# EAGLE schematic GUN PCB - SCHEMATICS (EAGLE 9.7.0)

## Sheet 1 of 5
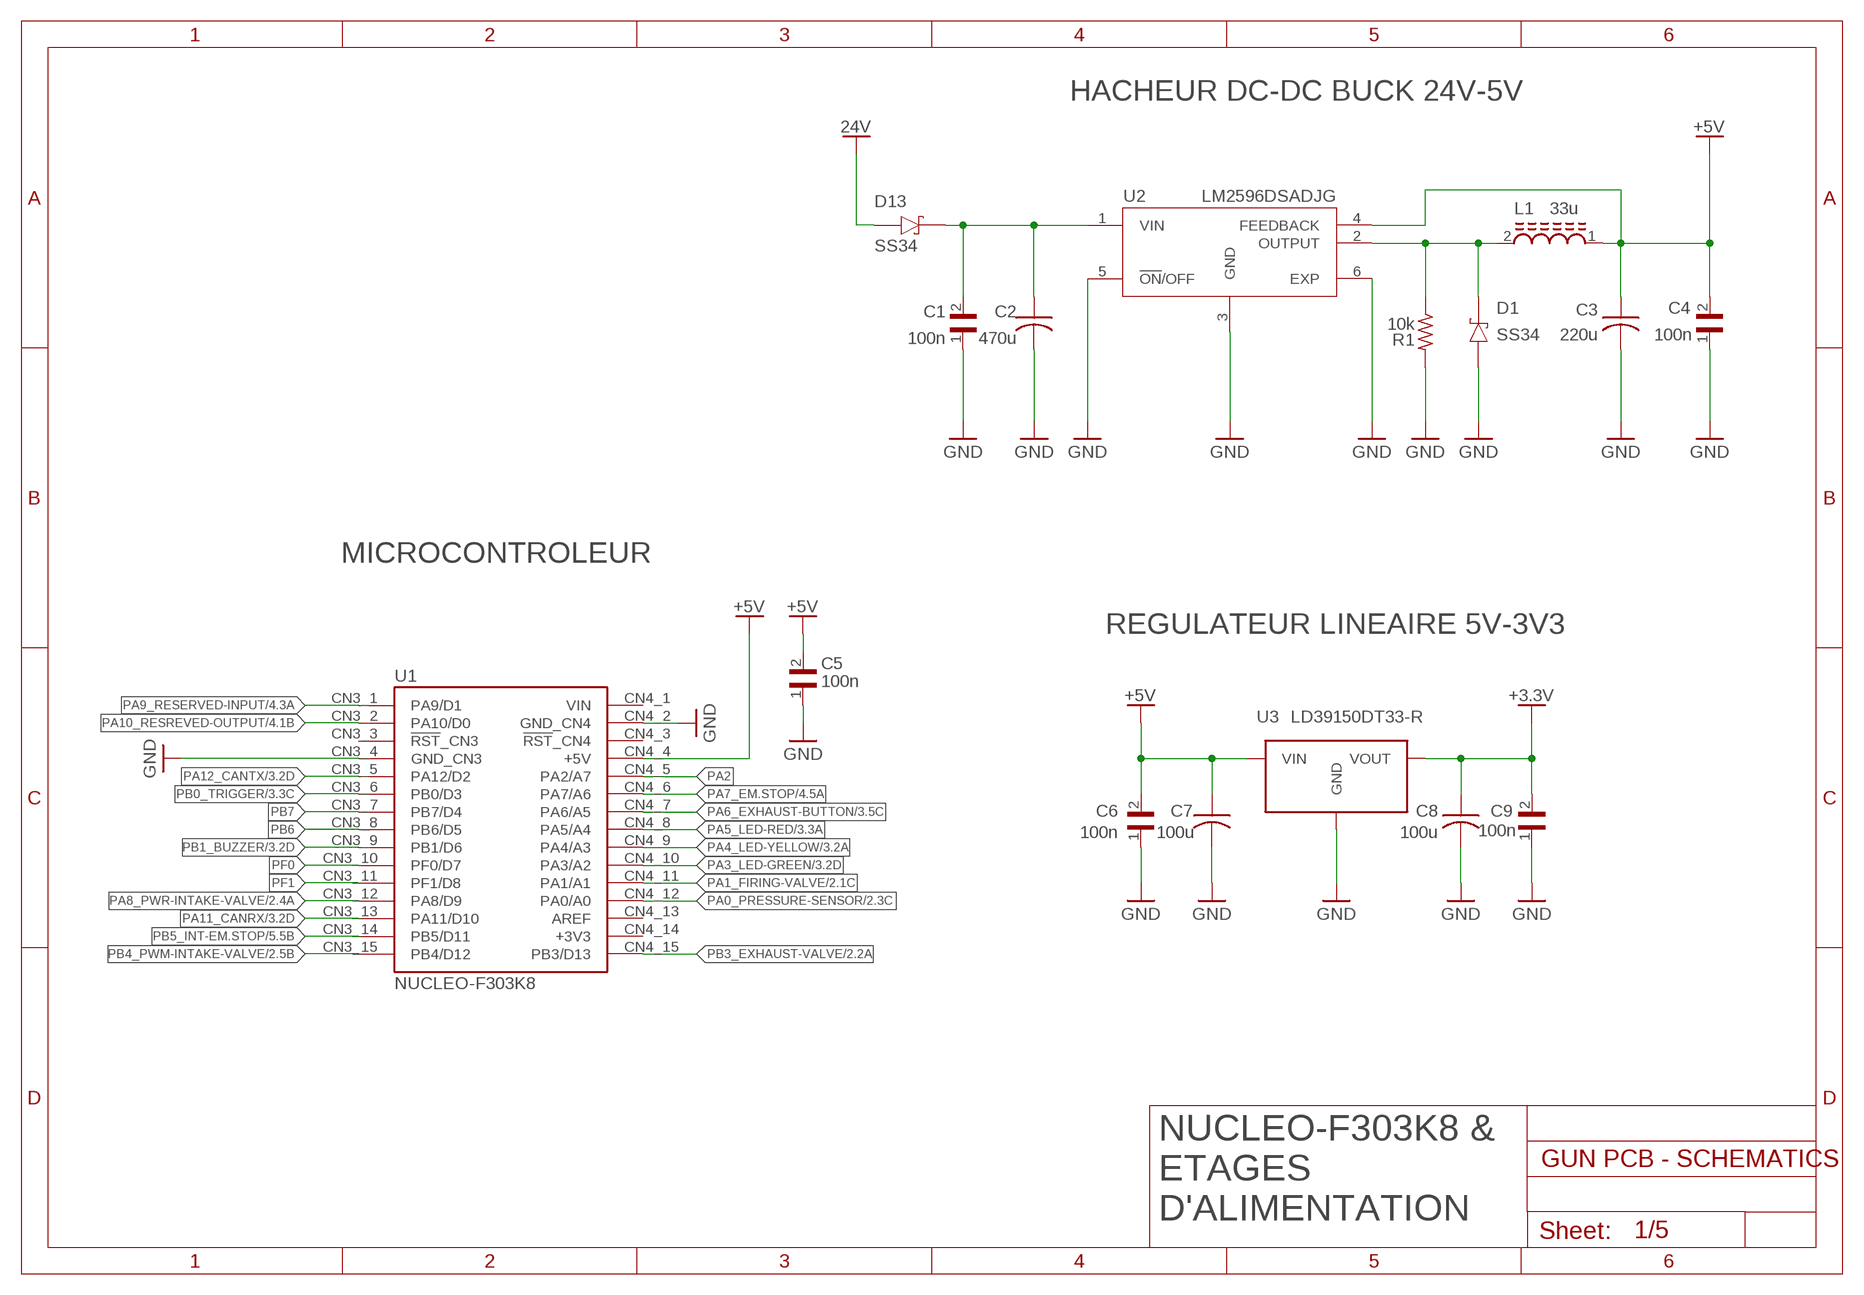
[diagram p0: schematic, sheet 1]

### Parts
C1  SR211C104KARTR1  [CAPRR508W50L508T317H508]
C2  ECA2CHG220  [CAPPRD500W60D1000H2000]
C3  EEUFC1E101SH  [CAPPRD250W50D630H1120]
C4  SR211C104KARTR1  [CAPRR508W50L508T317H508]
C5  SR211C104KARTR1  [CAPRR508W50L508T317H508]
C6  SR211C104KARTR1  [CAPRR508W50L508T317H508]
C7  ECEA1VKS470  [CAPPRD250W45D800H500]
C8  ECEA1VKS470  [CAPPRD250W45D800H500]
C9  SR211C104KARTR1  [CAPRR508W50L508T317H508]
D1  SS34  [DIO_SS34]
D13  SS34  [DIO_SS34]
L1  SRR1260-330M  [INDP125125X600N]
R1  10k  R-US_0204/7  [0204/7]
U1  NUCLEO-F042K6  [MODULE_NUCLEO-F042K6]
U2  LM2596DSADJG  [CONV_LM2596DSADJG]
U3  LD39150DT33-R  [DPAK]

### Nets
24V: D13.A ; also sheet 2,3,4
24V_SAFE: C1.2 C2.P D13.C(K) U2.1(VIN) ; also sheet 5
+3.3V: C8.P C9.2 U3.3(VOUT) ; also sheet 3,4,5
+5V: C3.P C4.2 C5.2 C6.2 C7.P L1.1 U1.CN4_4(+5V) U2.4(FEEDBACK) U3.1(VIN) ; also sheet 3,5
GND: C1.1 C2.N C3.N C4.1 C5.1 C6.1 C7.N C8.N C9.1 D1.A R1.2 U1.CN3_4(GND_CN3) U1.CN4_2(GND_CN4) U2.3(GND) U2.5(!ON!/OFF) U2.6(EXP) U3.2(GND) ; also sheet 2,3,4,5
N$2: D1.C(K) L1.2 R1.1 U2.2(OUTPUT)
PA0_PRESSURE-SENSOR: U1.CN4_12(PA0/A0) ; also sheet 2
PA1_FIRING-VALVE: U1.CN4_11(PA1/A1) ; also sheet 2
PA2: U1.CN4_5(PA2/A7)
PA3_LED-GREEN: U1.CN4_10(PA3/A2) ; also sheet 3
PA4_LED-YELLOW: U1.CN4_9(PA4/A3) ; also sheet 3
PA5_LED-RED: U1.CN4_8(PA5/A4) ; also sheet 3
PA6_EXHAUST-BUTTON: U1.CN4_7(PA6/A5) ; also sheet 3
PA7_EM.STOP: U1.CN4_6(PA7/A6) ; also sheet 4
PA8_PWR-INTAKE-VALVE: U1.CN3_12(PA8/D9) ; also sheet 2
PA9_RESERVED-INPUT: U1.CN3_1(PA9/D1) ; also sheet 4
PA10_RESREVED-OUTPUT: U1.CN3_2(PA10/D0) ; also sheet 4
PA11_CANRX: U1.CN3_13(PA11/D10) ; also sheet 3,5
PA12_CANTX: U1.CN3_5(PA12/D2) ; also sheet 3,5
PB0_TRIGGER: U1.CN3_6(PB0/D3) ; also sheet 3
PB1_BUZZER: U1.CN3_9(PB1/D6) ; also sheet 3
PB3_EXHAUST-VALVE: U1.CN4_15(PB3/D13) ; also sheet 2
PB4_PWM-INTAKE-VALVE: U1.CN3_15(PB4/D12) ; also sheet 2
PB5_INT-EM.STOP: U1.CN3_14(PB5/D11) ; also sheet 5
PB6: U1.CN3_8(PB6/D5)
PB7: U1.CN3_7(PB7/D4)
PF0: U1.CN3_10(PF0/D7)
PF1: U1.CN3_11(PF1/D8)
Unconnected: U1.CN3_3(!RST!_CN3) U1.CN4_3(!RST!_CN4) U1.CN4_13(AREF)

### Notes on the sheet
- HACHEUR DC-DC BUCK 24V-5V
- 33u
- 100n | 470u | 220u | 100n
- MICROCONTROLEUR
- REGULATEUR LINEAIRE 5V-3V3
- C5
- 100n
- 100n | 100u | 100u | 100n
- NUCLEO-F303K8
- NUCLEO-F303K8 &
  ETAGES 
  D'ALIMENTATION

## Sheet 2 of 5
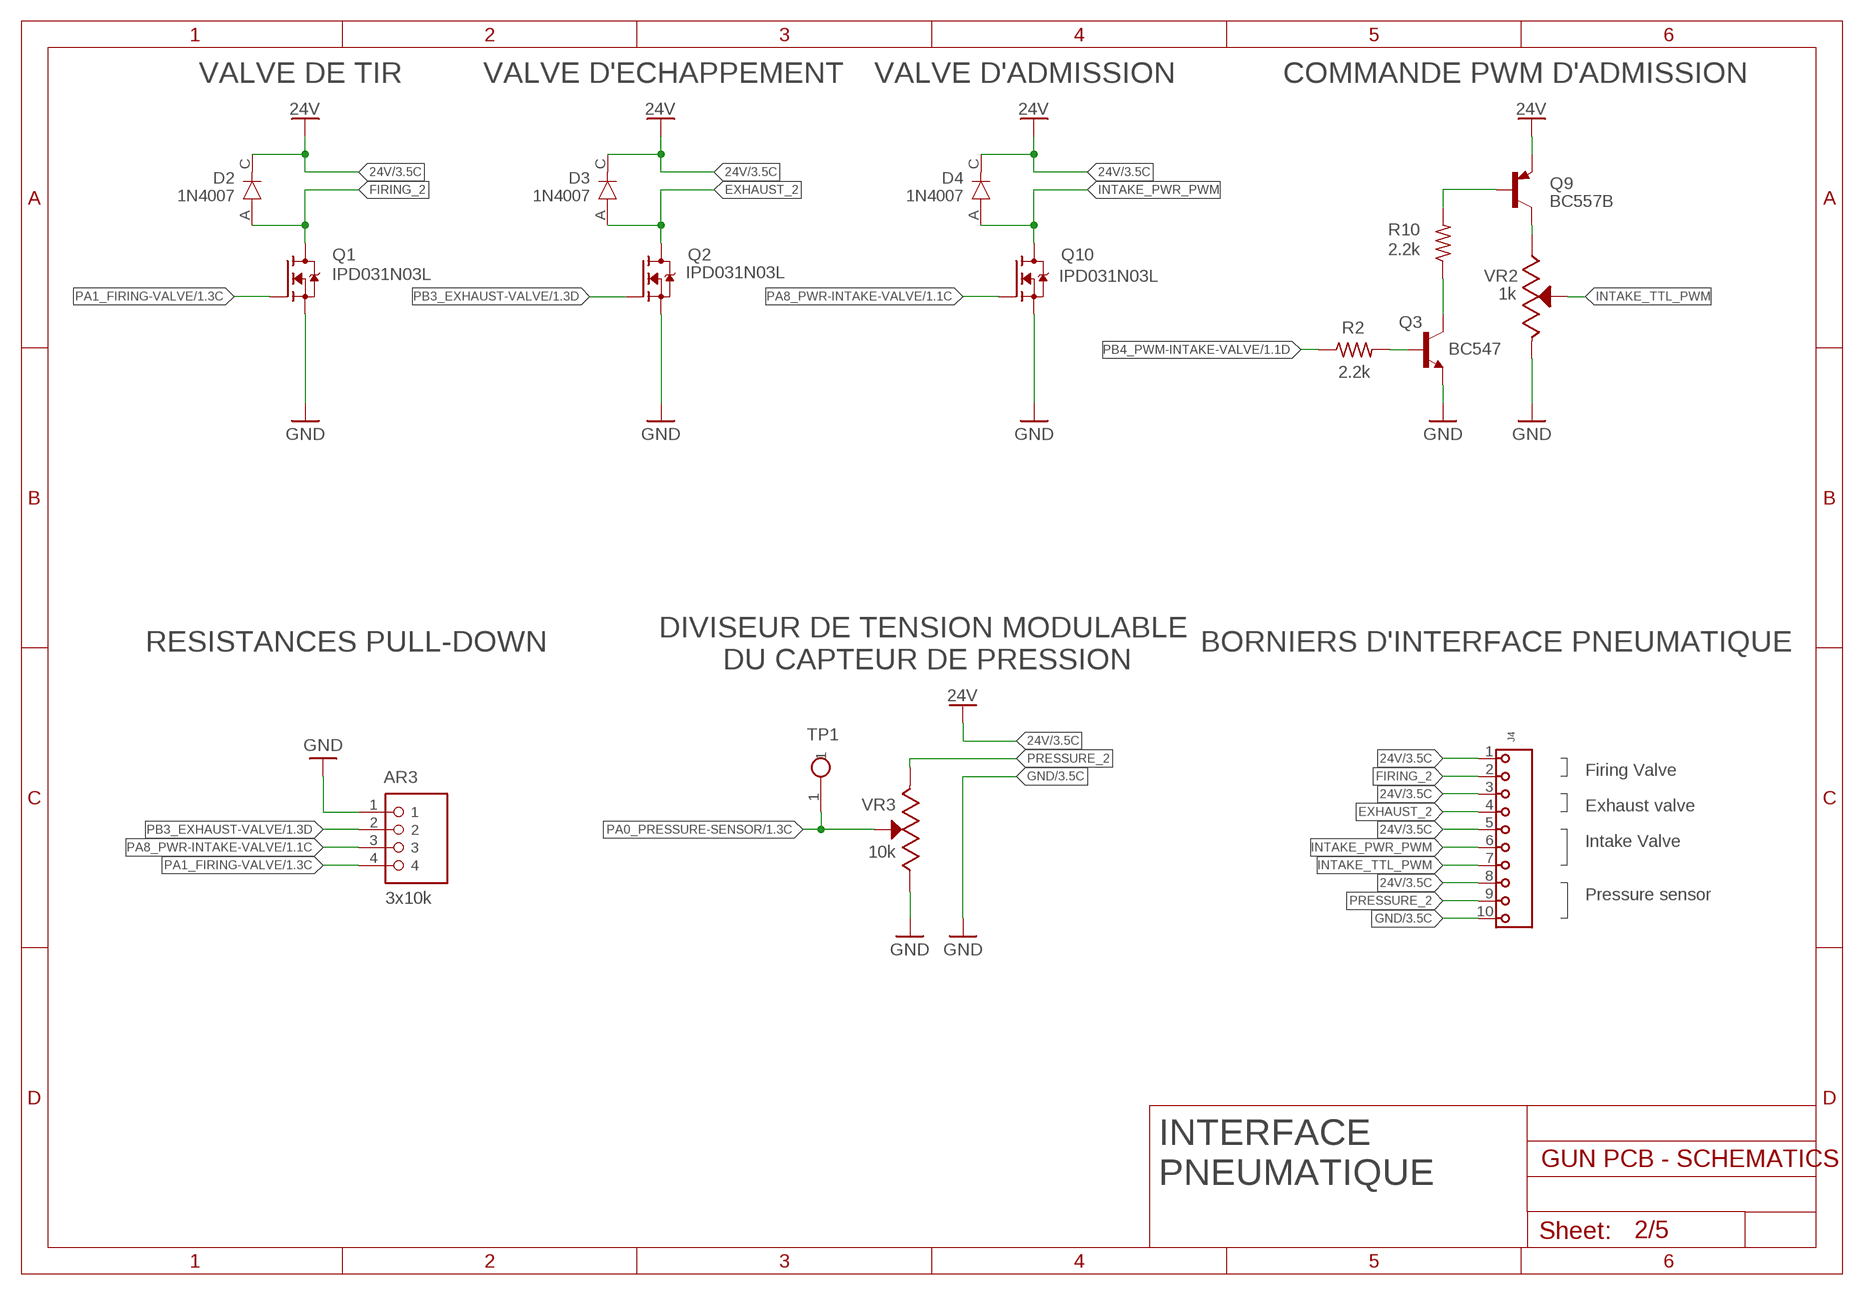
[diagram p1: schematic, sheet 2]

### Parts
AR3  10K10KX4  [10K]
D2  1N4007  [DIOAD1060W80L520D270]
D3  1N4007  [DIOAD1060W80L520D270]
D4  1N4007  [DIOAD1060W80L520D270]
J4  691241510010  [691241510010]
Q1  IRF520NSTRL  [TRANS_IRF520NSTRL]
Q2  IRF520NSTRL  [TRANS_IRF520NSTRL]
Q3  BC547  [TO92]
Q9  BC557B  [TO92254P460H750-3]
Q10  IRF520NSTRL  [TRANS_IRF520NSTRL]
R2  2.2k  R-US_0204/7  [0204/7]
R10  2.2k  R-US_0204/7  [0204/7]
TP1  TP  [TP355X200]
VR2  3296W-1-502  [TRIM_3296W-1-502]
VR3  3299Y-1-104LF  [3299Y1104LF]

### Nets
24V: D2.C D3.C D4.C J4.1 J4.3 J4.5 J4.8 Q9.3(E) ; also sheet 1,3,4
EXHAUST_2: D3.A J4.4 Q2.2(D)
FIRING_2: D2.A J4.2 Q1.2(D)
GND: AR3.1 J4.10 Q1.3(S) Q2.3(S) Q3.1(E) Q10.3(S) VR2.3(CW) VR3.1 ; also sheet 1,3,4,5
INTAKE_PWR_PWM: D4.A J4.6 Q10.2(D)
INTAKE_TTL_PWM: J4.7 VR2.2(WIPER)
N$3: Q3.2(B) R2.2
N$5: Q3.3(C) R10.1
N$6: Q9.2(B) R10.2
N$7: Q9.1(C) VR2.1(CCW)
PA0_PRESSURE-SENSOR: TP1.1 VR3.2 ; also sheet 1
PA1_FIRING-VALVE: AR3.4 Q1.1(G) ; also sheet 1
PA8_PWR-INTAKE-VALVE: AR3.3 Q10.1(G) ; also sheet 1
PB3_EXHAUST-VALVE: AR3.2 Q2.1(G) ; also sheet 1
PB4_PWM-INTAKE-VALVE: R2.1 ; also sheet 1
PRESSURE_2: J4.9 VR3.3

### Notes on the sheet
- VALVE DE TIR | VALVE D'ECHAPPEMENT | VALVE D'ADMISSION | COMMANDE PWM D'ADMISSION
- IPD031N03L | IPD031N03L | IPD031N03L
- 1k
- RESISTANCES PULL-DOWN | BORNIERS D'INTERFACE PNEUMATIQUE
- DIVISEUR DE TENSION MODULABLE 
  DU CAPTEUR DE PRESSION
- Firing Valve
- Exhaust valve
- 10k | Intake Valve
- 3x10k | Pressure sensor
- INTERFACE 
  PNEUMATIQUE

## Sheet 3 of 5
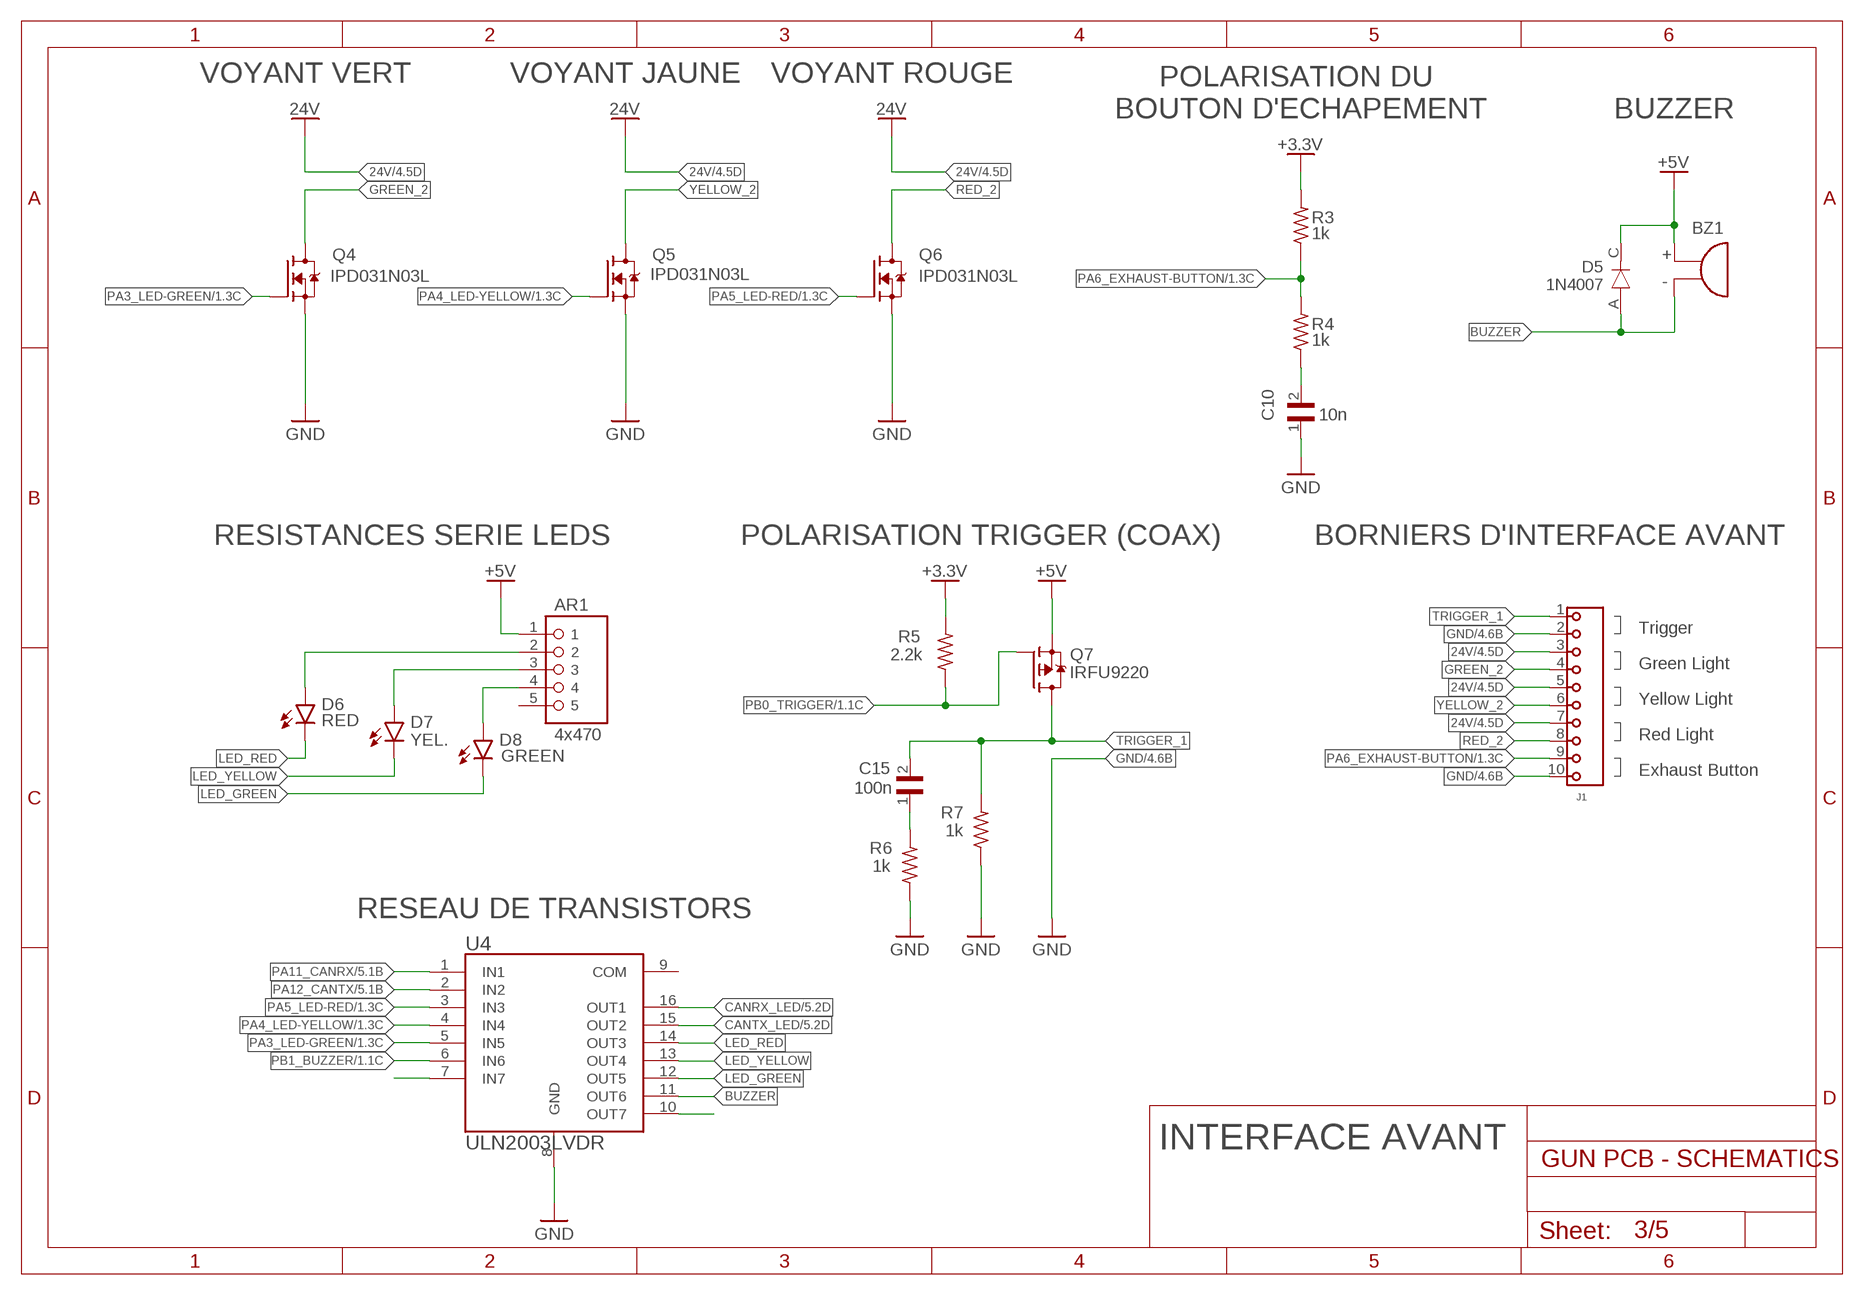
[diagram p2: schematic, sheet 3]

### Parts
AR1  470  [470]
BZ1  KSSG1201-16  [XDCR_KSSG1201-16]
C10  SR211C104KARTR1  [CAPRR508W50L508T317H508]
C15  SR211C104KARTR1  [CAPRR508W50L508T317H508]
D5  1N4007  [DIOAD1060W80L520D270]
D6  LED_RADIALRED  [LEDRD254W60D565H860B_R]
D7  LED_RADIALYELLOW  [LEDRD254W60D565H860B_Y]
D8  LED_RADIALWHITE  [LEDRD254W60D565H860B_W]
J1  691241510010  [691241510010]
Q4  IRF520NSTRL  [TRANS_IRF520NSTRL]
Q5  IRF520NSTRL  [TRANS_IRF520NSTRL]
Q6  IRF520NSTRL  [TRANS_IRF520NSTRL]
Q7  IRFU9220  [TO229P673X239X978-3N]
R3  1k  R-US_0204/7  [0204/7]
R4  1k  R-US_0204/7  [0204/7]
R5  2.2k  R-US_0204/7  [0204/7]
R6  1k  R-US_0204/7  [0204/7]
R7  1k  R-US_0204/7  [0204/7]
U4  ULN2003LVDR  [SOIC127P600X175-16N]

### Nets
24V: J1.3 J1.5 J1.7 ; also sheet 1,2,4
+3.3V: R3.2 R5.2 ; also sheet 1,4,5
+5V: AR1.1 BZ1.P(POS) D5.C Q7.3(S) ; also sheet 1,5
BUZZER: BZ1.N(NEG) D5.A U4.11(OUT6)
CANRX_LED: U4.16(OUT1) ; also sheet 5
CANTX_LED: U4.15(OUT2) ; also sheet 5
GND: C10.1 J1.2 J1.10 Q4.3(S) Q5.3(S) Q6.3(S) R6.1 R7.1 U4.8(GND) ; also sheet 1,2,4,5
GREEN_2: J1.4 Q4.2(D)
LED_GREEN: D8.C U4.12(OUT5)
LED_RED: D6.C U4.14(OUT3)
LED_YELLOW: D7.C U4.13(OUT4)
N$4: C15.1 R6.2
N$8: C10.2 R4.1
N$19: U4.7(IN7)
N$21: AR1.2 D6.A
N$22: AR1.4 D8.A
N$23: AR1.3 D7.A
N$29: U4.10(OUT7)
PA3_LED-GREEN: Q4.1(G) U4.5(IN5) ; also sheet 1
PA4_LED-YELLOW: Q5.1(G) U4.4(IN4) ; also sheet 1
PA5_LED-RED: Q6.1(G) U4.3(IN3) ; also sheet 1
PA6_EXHAUST-BUTTON: J1.9 R3.1 R4.2 ; also sheet 1
PA11_CANRX: U4.1(IN1) ; also sheet 1,5
PA12_CANTX: U4.2(IN2) ; also sheet 1,5
PB0_TRIGGER: Q7.1(G) R5.1 ; also sheet 1
PB1_BUZZER: U4.6(IN6) ; also sheet 1
RED_2: J1.8 Q6.2(D)
TRIGGER_1: C15.2 J1.1 Q7.2(D) R7.2
YELLOW_2: J1.6 Q5.2(D)
Unconnected: AR1.5 U4.9(COM)

### Notes on the sheet
- VOYANT VERT | VOYANT JAUNE | VOYANT ROUGE
- POLARISATION DU 
  BOUTON D'ECHAPEMENT
- BUZZER
- IPD031N03L | IPD031N03L | IPD031N03L
- 10n
- RESISTANCES SERIE LEDS | POLARISATION TRIGGER (COAX) | BORNIERS D'INTERFACE AVANT
- Trigger
- Green Light
- Yellow Light
- RED
- 4x470 | Red Light
- YEL.
- GREEN
- Exhaust Button
- 100n
- RESEAU DE TRANSISTORS
- INTERFACE AVANT

## Sheet 4 of 5
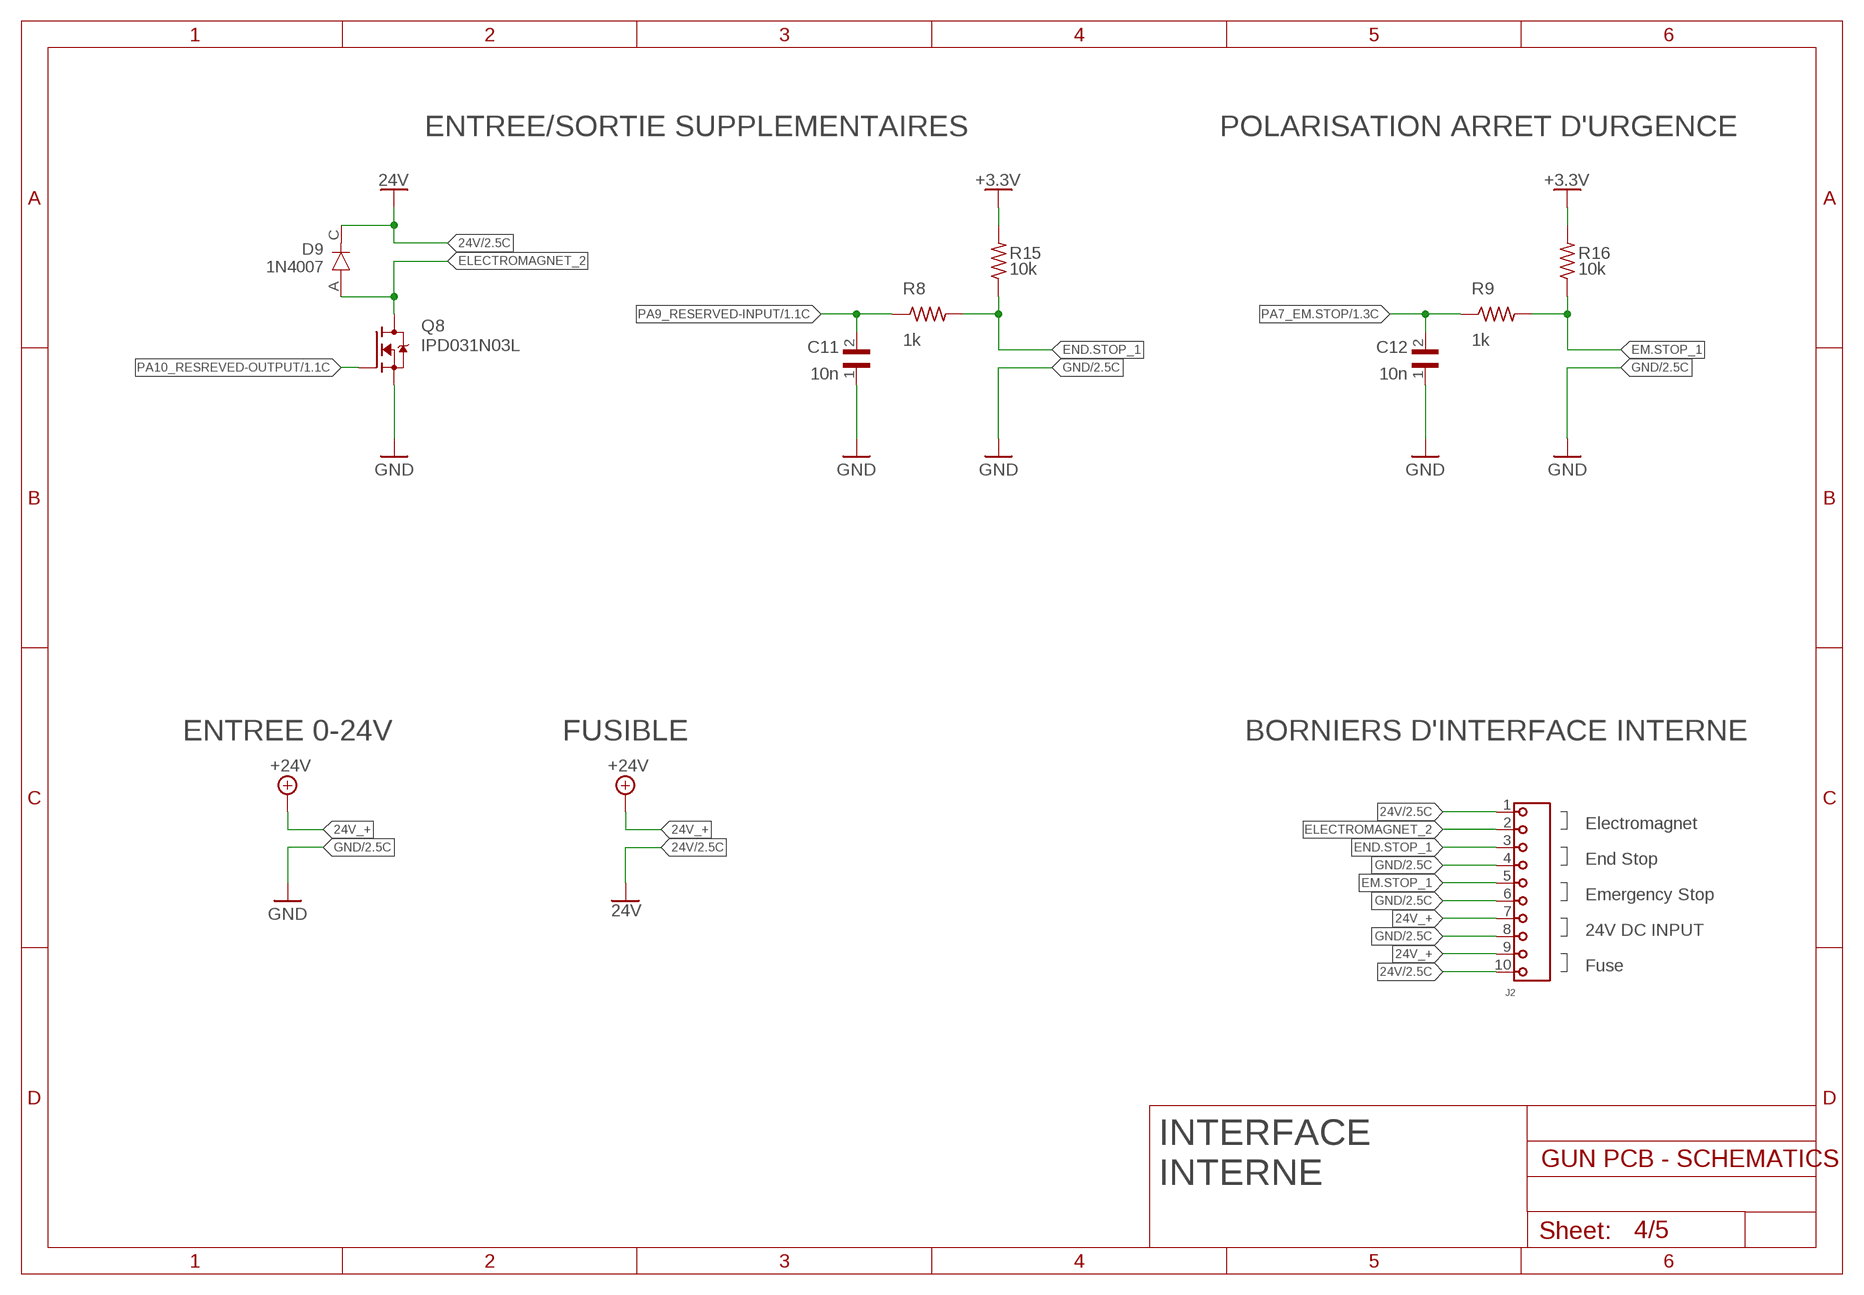
[diagram p3: schematic, sheet 4]

### Parts
C11  SR211C104KARTR1  [CAPRR508W50L508T317H508]
C12  SR211C104KARTR1  [CAPRR508W50L508T317H508]
D9  1N4007  [DIOAD1060W80L520D270]
J2  691241510010  [691241510010]
Q8  IRF520NSTRL  [TRANS_IRF520NSTRL]
R8  1k  R-US_0204/7  [0204/7]
R9  1k  R-US_0204/7  [0204/7]
R15  10k  R-US_0204/7  [0204/7]
R16  10k  R-US_0204/7  [0204/7]

### Nets
24V: D9.C J2.1 J2.10 ; also sheet 1,2,3
24V_+: J2.7 J2.9 ; supply symbol labelled +24V
+3.3V: R15.2 R16.2 ; also sheet 1,3,5
ELECTROMAGNET_2: D9.A J2.2 Q8.2(D)
EM.STOP_1: J2.5 R9.2 R16.1
END.STOP_1: J2.3 R8.2 R15.1
GND: C11.1 C12.1 J2.4 J2.6 J2.8 Q8.3(S) ; also sheet 1,2,3,5
PA7_EM.STOP: C12.2 R9.1 ; also sheet 1
PA9_RESERVED-INPUT: C11.2 R8.1 ; also sheet 1
PA10_RESREVED-OUTPUT: Q8.1(G) ; also sheet 1

### Notes on the sheet
- ENTREE/SORTIE SUPPLEMENTAIRES | POLARISATION ARRET D'URGENCE
- IPD031N03L
- 10n | 10n
- ENTREE 0-24V | FUSIBLE | BORNIERS D'INTERFACE INTERNE
- Electromagnet
- End Stop
- Emergency Stop
- 24V DC INPUT
- Fuse
- INTERFACE 
  INTERNE

## Sheet 5 of 5
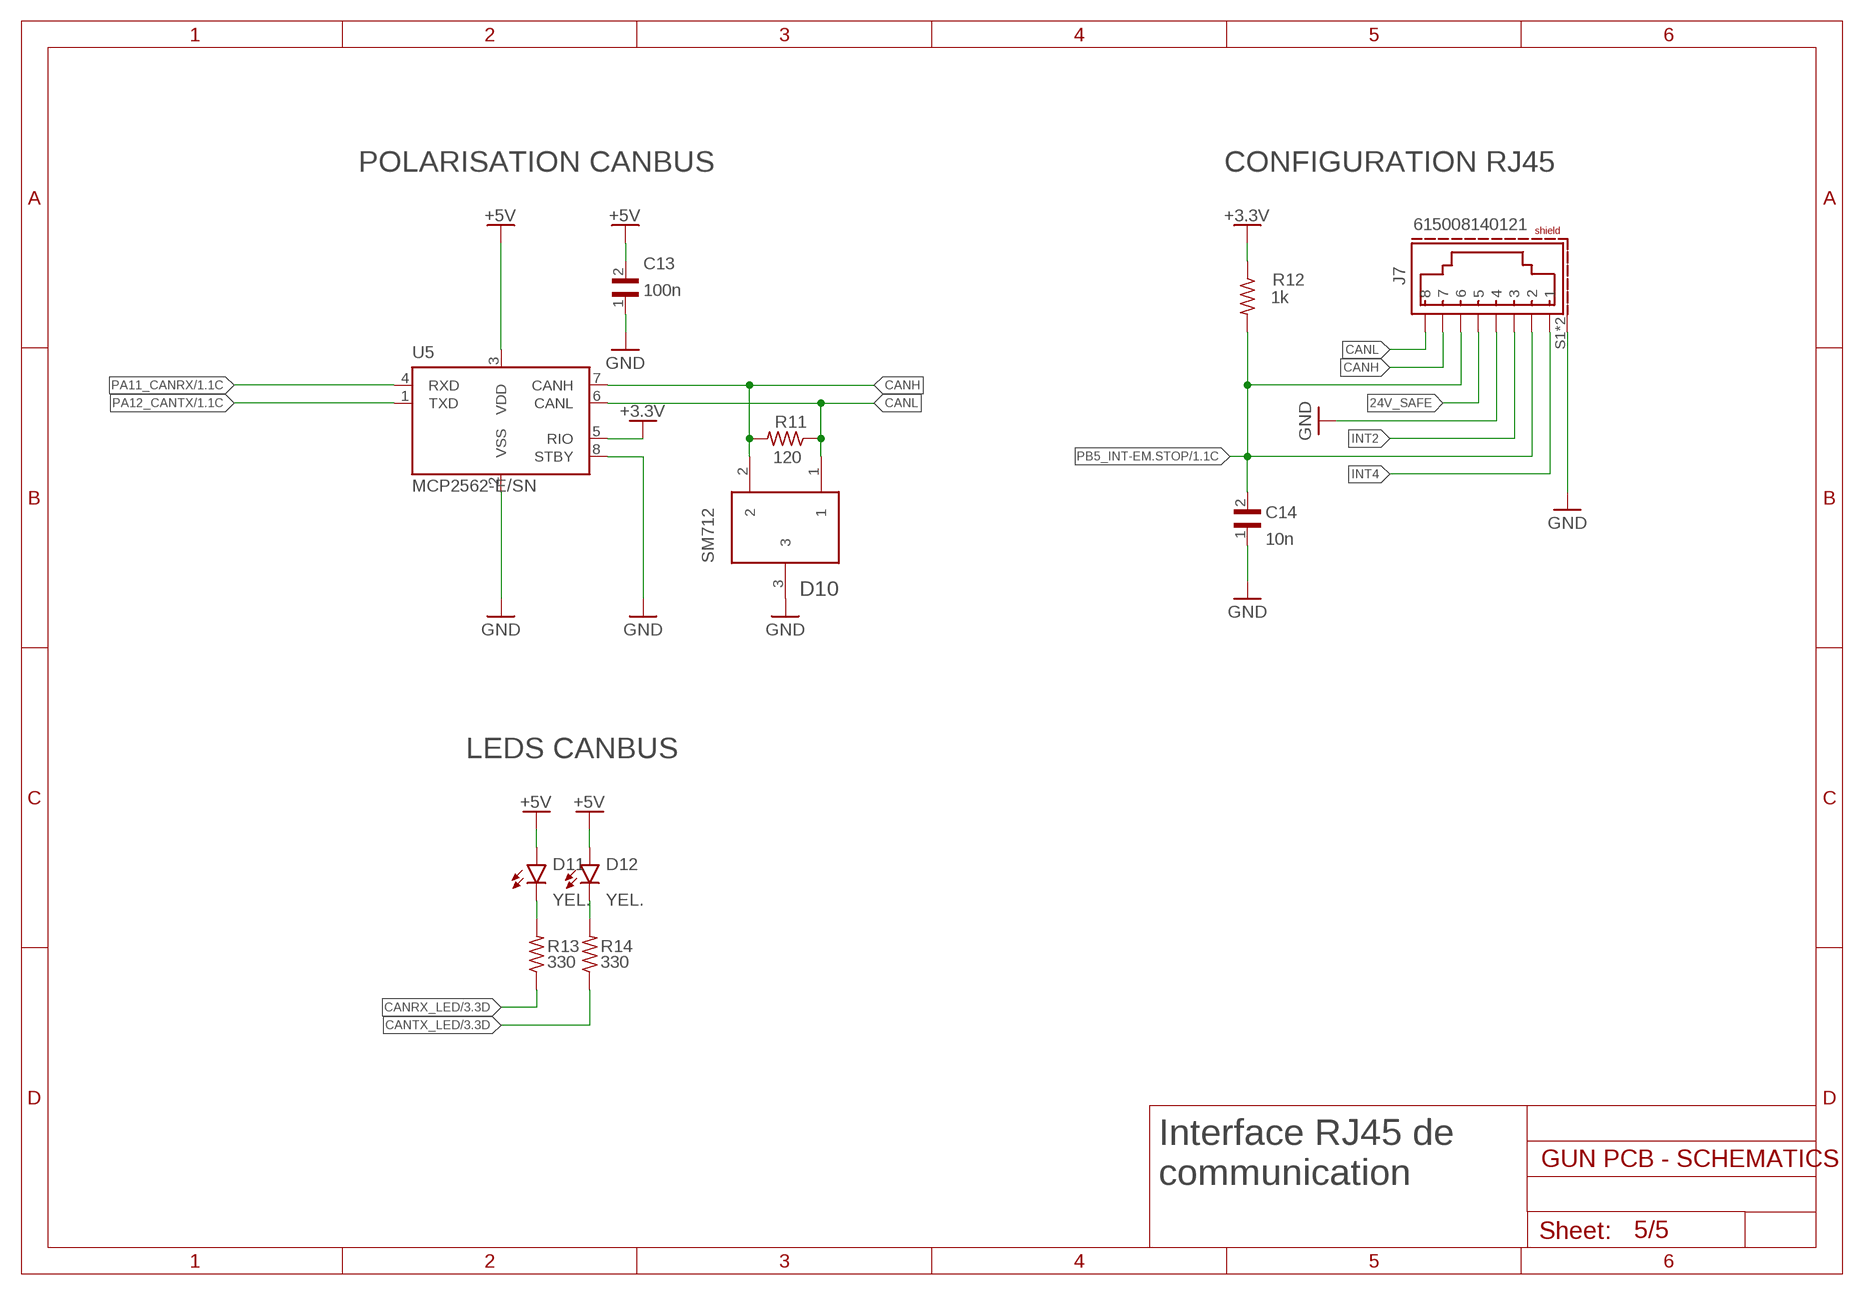
[diagram p4: schematic, sheet 5]

### Parts
C13  SR211C104KARTR1  [CAPRR508W50L508T317H508]
C14  SR211C104KARTR1  [CAPRR508W50L508T317H508]
D10  SM712.TCT  [SOT23]
D11  LED_RADIALYELLOW  [LEDRD254W60D565H860B_Y]
D12  LED_RADIALYELLOW  [LEDRD254W60D565H860B_Y]
J7  615008140121  [615008140121]
R11  120  R-US_0204/7  [0204/7]
R12  1k  R-US_0204/7  [0204/7]
R13  330  R-US_0204/7  [0204/7]
R14  330  R-US_0204/7  [0204/7]
U5  MCP2562-E/SN  [SOIC127P600X175-8N]

### Nets
24V_SAFE: J7.5 ; also sheet 1
+3.3V: R12.1 U5.5(RIO) ; also sheet 1,3,4
+5V: C13.2 D11.A D12.A U5.3(VDD) ; also sheet 1,3
CANH: D10.2 J7.7 R11.2 U5.7(CANH)
CANL: D10.1 J7.8 R11.1 U5.6(CANL)
CANRX_LED: R13.1 ; also sheet 3
CANTX_LED: R14.1 ; also sheet 3
GND: C13.1 C14.1 D10.3 J7.4 J7.S1(SHIELD) J7.S2(SHIELD) U5.2(VSS) U5.8(STBY) ; also sheet 1,2,3,4
INT2: J7.3
INT4: J7.1
N$36: D11.C R13.2
N$37: D12.C R14.2
PA11_CANRX: U5.4(RXD) ; also sheet 1,3
PA12_CANTX: U5.1(TXD) ; also sheet 1,3
PB5_INT-EM.STOP: C14.2 J7.2 J7.6 R12.2 ; also sheet 1

### Notes on the sheet
- POLARISATION CANBUS | CONFIGURATION RJ45
- 100n
- 10n
- LEDS CANBUS
- YEL. | YEL.
- Interface RJ45 de 
  communication

## Power pins joined to a net without a drawn wire
+3V3: U1.CN4_14(+3V3)
VIN: U1.CN4_1(VIN)

## Library data of the parts
AR1 = Network resistors 470 x4:470: Check availability <https://pricing.snapeda.com/parts/1725656/Phoenix%20Contact/view-part?ref=eda>
AR3 = Network resistors 10k x3:10K: Check availability <https://pricing.snapeda.com/parts/1725656/Phoenix%20Contact/view-part?ref=eda>
BZ1 = Buzzer:KSSG1201-16: Check availability <https://pricing.snapeda.com/parts/KSSG1201-16/Kingstate/view-part?ref=eda>; AVAILABILITY: In Stock; CHECK_PRICES: https://www.snapeda.com/parts/KSSG1201-16/Kingstate/view-part/?ref=eda; DESCRIPTION: MAGNETIC TRANSDUCER, PCB; Transducer Function:Buzzer; Supply Voltage Min:1V; Supply Voltage Max:-; Current Rating:35mA; Tones:-; Sound Level SPL:85dB; Resonant Frequency:2kHz; Transducer Mounting:-; Product Range:-; SVHC:No SVHC RoHS Compliant: Yes; MF: Kingstate; MP: KSSG1201-16; PACKAGE: None; PRICE: None; SNAPEDA_LINK: https://www.snapeda.com/parts/KSSG1201-16/Kingstate/view-part/?ref=snap
C1 C4-C6 C9-C15 = 100nF:SR211C104KARTR1: Check availability <https://pricing.snapeda.com/parts/SR211C104KARTR1/AVX/view-part?ref=eda>; AVAILABILITY: In Stock; CHECK_PRICES: https://www.snapeda.com/parts/SR211C104KARTR1/AVX/view-part/?ref=eda; DESCRIPTION: 0.1 µF ±10% 100V Ceramic Capacitor X7R Radial; MF: AVX; MP: SR211C104KARTR1; PACKAGE: Radial AVX Interconnect / Elco; PRICE: None; SNAPEDA_LINK: https://www.snapeda.com/parts/SR211C104KARTR1/AVX/view-part/?ref=snap
C2 = 680uF 35V:ECA2CHG220: Check availability <https://pricing.snapeda.com/parts/ECA2CHG220/Panasonic/view-part?ref=eda>; AVAILABILITY: In Stock; CHECK_PRICES: https://www.snapeda.com/parts/ECA2CHG220/Panasonic/view-part/?ref=eda; DESCRIPTION: Capacitor; Alum Electrolytic; Cap 22 uF; Tol 20%; Vol-Rtg 160 VDC; Radial; 10x20; Bulk; MF: Panasonic; MP: ECA2CHG220; PACKAGE: RADIAL-2 Panasonic; PRICE: None; SNAPEDA_LINK: https://www.snapeda.com/parts/ECA2CHG220/Panasonic/view-part/?ref=snap
C3 = 220uF 10V:EEUFC1E101SH: Check availability <https://pricing.snapeda.com/parts/EEU-FC1E101SH/Panasonic/view-part?ref=eda>; AVAILABILITY: In Stock; CHECK_PRICES: https://www.snapeda.com/parts/EEU-FC1E101SH/Panasonic/view-part/?ref=eda; DESCRIPTION: Capacitor,Alum Lytic,Cap 100 uF,Tol 20%,Vol-Rtg 25 VDC,Radial,6.3x11,Tape&Box | Panasonic Electronic Components EEU-FC1E101SH; MF: Panasonic; MP: EEU-FC1E101SH; PACKAGE: RADIAL-2 Panasonic; PRICE: None; SNAPEDA_LINK: https://www.snapeda.com/parts/EEU-FC1E101SH/Panasonic/view-part/?ref=snap
C7 C8 = 100uF 25V:ECEA1VKS470: Check availability <https://pricing.snapeda.com/parts/ECE-A1VKS470/Panasonic/view-part?ref=eda>; AVAILABILITY: In Stock; CHECK_PRICES: https://www.snapeda.com/parts/ECE-A1VKS470/Panasonic/view-part/?ref=eda; DESCRIPTION: Capacitor,Alum Electrolytic,Cap 47 uF,Tol 20%,Vol-Rtg 35 VDC,Radial,8x5,Bulk | Panasonic Electronic Components ECE-A1VKS470; MF: Panasonic; MP: ECE-A1VKS470; PACKAGE: RADIAL-2 Panasonic; PRICE: None; SNAPEDA_LINK: https://www.snapeda.com/parts/ECE-A1VKS470/Panasonic/view-part/?ref=snap
D1 D13 = SS34:SS34: Check availability <https://pricing.snapeda.com/parts/SS34/Taiwan%20Semiconductor/view-part?ref=eda>; AVAILABILITY: In Stock; CHECK_PRICES: https://www.snapeda.com/parts/SS34/taiwan/view-part/?ref=eda; DESCRIPTION: 3A, 40V, Schottky Rectifier; MF: Taiwan Semiconductor; MP: SS34; PACKAGE: DO-214AB-2 Taiwan Semiconductor; PRICE: None; SNAPEDA_LINK: https://www.snapeda.com/parts/SS34/taiwan/view-part/?ref=snap
D2-D5 D9 = 1N4007:1N4007: Check availability <https://pricing.snapeda.com/parts/1N4007/Diotec%20Semiconductor/view-part?ref=eda>; AVAILABILITY: In Stock; CHECK_PRICES: https://www.snapeda.com/parts/1N4007/Diotec/view-part/?ref=eda; DESCRIPTION: Diode, DO-41, 1000V, 1A, 175°C; MF: Diotec Semiconductor; MP: 1N4007; PACKAGE: DO-41 Diotec; PRICE: None; SNAPEDA_LINK: https://www.snapeda.com/parts/1N4007/Diotec/view-part/?ref=snap
D6-D8 D11 D12 = LED:LED_RADIAL: LED - Generic
D10 = SM712:SM712.TCT: Check availability <https://pricing.snapeda.com/parts/SM712.TCT/Semtech%20Corporation/view-part?ref=eda>; AVAILABILITY: In Stock; CHECK_PRICES: https://www.snapeda.com/parts/SM712.TCT/Semtech/view-part/?ref=eda; DESCRIPTION: SM Series 12 V 400 W Asymmetrical TVS Diode for Extended Common-Mode - SOT-23; MF: Semtech Corporation; MP: SM712.TCT; PACKAGE: SOT-23 Semtech; PRICE: None; SNAPEDA_LINK: https://www.snapeda.com/parts/SM712.TCT/Semtech/view-part/?ref=snap
J1 J2 J4 = Bornier 10 contacts:691241510010: Check availability <https://pricing.snapeda.com/parts/691241510010/W%C3%BCrth%20Elektronik/view-part?ref=eda>; AVAILABILITY: In Stock; CHECK_PRICES: https://www.snapeda.com/parts/691241510010/W%25C3%25BCrth+Elektronik+Midcom/view-part/?ref=eda; DESCRIPTION: 10 Position Wire to Board Terminal Block Horizontal with Board 0.200 (5.08mm) Through Hole; MF: Würth Elektronik; MP: 691241510010; PACKAGE: None; PRICE: None; SNAPEDA_LINK: https://www.snapeda.com/parts/691241510010/W%25C3%25BCrth+Elektronik+Midcom/view-part/?ref=snap
J7 = Ethernet connector:615008140121: Check availability <https://pricing.snapeda.com/parts/615008140121/Wurth%20Elektronik/view-part?ref=eda>; AVAILABILITY: In Stock; CHECK_PRICES: https://www.snapeda.com/parts/615008140121/Wurth+Electronics/view-part/?ref=eda; DESCRIPTION: ModularJack_8P8C_THT_Horizontal_Shielded_Tab Down; MF: Wurth Elektronik; MP: 615008140121; PACKAGE: None; PRICE: None; SNAPEDA_LINK: https://www.snapeda.com/parts/615008140121/Wurth+Electronics/view-part/?ref=snap
L1 = 33uH 3A:SRR1260-330M: Check availability <https://pricing.snapeda.com/parts/SRR1260-330M/Bourns%20-%20J.W.%20Miller/view-part?ref=eda>; AVAILABILITY: In Stock; CHECK_PRICES: https://www.snapeda.com/parts/SRR1260-330M/Bourns/view-part/?ref=eda; DESCRIPTION: 33 µH Shielded Drum Core, Wirewound Inductor 3 A 60mOhm Max Nonstandard; MF: Bourns - J.W. Miller; MP: SRR1260-330M; PACKAGE: Nonstandard Bourns - J.W. Miller; PRICE: None; SNAPEDA_LINK: https://www.snapeda.com/parts/SRR1260-330M/Bourns/view-part/?ref=snap
Q1 Q2 Q4-Q6 Q8 Q10 = IRF520N SMD/DIP:IRF520NSTRL: Check availability <https://pricing.snapeda.com/parts/IRF520NSTRL/Infineon%20Technologies/view-part?ref=eda>; AVAILABILITY: In Stock; CHECK_PRICES: https://www.snapeda.com/parts/IRF520NSTRL/Infineon/view-part/?ref=eda; DESCRIPTION: N-Channel 100 V 9.7A (Tc) 3.8W (Ta), 48W (Tc) Surface Mount D2PAK; MF: Infineon Technologies; MP: IRF520NSTRL; PACKAGE: None; PRICE: None; SNAPEDA_LINK: https://www.snapeda.com/parts/IRF520NSTRL/Infineon/view-part/?ref=snap
Q3 = BC547:BC547: Check availability <https://pricing.snapeda.com/parts/BC547/ON%20Semiconductor/view-part?ref=eda>; AVAILABILITY: In Stock; CHECK_PRICES: https://www.snapeda.com/parts/BC547/Onsemi/view-part/?ref=eda; DESCRIPTION: Trans GP BJT NPN 45V 0.1A 500mW 3-Pin TO-92 T/R; MF: ON Semiconductor; MP: BC547; PACKAGE: None; PRICE: None; SNAPEDA_LINK: https://www.snapeda.com/parts/BC547/Onsemi/view-part/?ref=snap
Q7 = IRFU9220:IRFU9220: Check availability <https://pricing.snapeda.com/parts/IRFU9310PBF/Vishay%20Siliconix/view-part?ref=eda>; AVAILABILITY: In Stock; CHECK_PRICES: https://www.snapeda.com/parts/IRFU9310PBF/Vishay/view-part/?ref=eda; DESCRIPTION: P-Channel 400 V 1.8A (Tc) 50W (Tc) Through Hole TO-251AA; MF: Vishay Siliconix; MP: IRFU9310PBF; PACKAGE: TO-251 Vishay; PRICE: None; SNAPEDA_LINK: https://www.snapeda.com/parts/IRFU9310PBF/Vishay/view-part/?ref=snap
Q9 = BC557B:BC557B: Check availability <https://pricing.snapeda.com/parts/BC557B/Diotec%20Semiconductor/view-part?ref=eda>; AVAILABILITY: In Stock; CHECK_PRICES: https://www.snapeda.com/parts/BC557B/Diotec/view-part/?ref=eda; DESCRIPTION: BJT, TO-92, 45V, 100mA, PNP, 0.5W, 150°C; MF: Diotec Semiconductor; MP: BC557B; PACKAGE: TO-92 Diotec; PRICE: None; SNAPEDA_LINK: https://www.snapeda.com/parts/BC557B/Diotec/view-part/?ref=snap
R1-R16 = rcl:R-US_: RESISTOR, American symbol; SPICEPREFIX: R
TP1 = PROBE_POINT:TP: Check availability <https://pricing.snapeda.com/parts/RCW0C/TE%20Connectivity/view-part?ref=eda>; AVAILABILITY: In Stock; CHECK_PRICES: https://www.snapeda.com/parts/RCW0C/TE+Connectivity/view-part/?ref=eda; DESCRIPTION: TEST POINT, 1206 CASE SIZE; Accessory Type:SMD Circuit Probe Pad; For Use With:-; SVHC:No SVHC (27-Jun-2018); Board Connector / Footprint:Test Point; Current Rating:2A; External Depth:1.6mm; External Length / Height:2mm; External Width:2.3mm; Height:2mm; Operating Temperature Max:125°C; Operating Temperature Min:-55°C; Product Range:Tyco RC Series; MF: TE Connectivity; MP: RCW0C; PACKAGE: None; PRICE: None; SNAPEDA_LINK: https://www.snapeda.com/parts/RCW0C/TE+Connectivity/view-part/?ref=snap
U1 = NUCLEO-F303K8:NUCLEO-F042K6: Check availability <https://pricing.snapeda.com/parts/NUCLEO-F042K6/STMicroelectronics/view-part?ref=eda>; AVAILABILITY: In Stock; CHECK_PRICES: https://www.snapeda.com/parts/NUCLEO-F042K6/STMicroelectronics/view-part/?ref=eda; DESCRIPTION: STM32F042K6, mbed-Enabled Development Nucleo-32 STM32F0 ARM® Cortex®-M0 MCU 32-Bit Embedded Evaluation Board; MF: STMicroelectronics; MP: NUCLEO-F042K6; PACKAGE: None; PRICE: None; SNAPEDA_LINK: https://www.snapeda.com/parts/NUCLEO-F042K6/STMicroelectronics/view-part/?ref=snap
U2 = LM2596:LM2596DSADJG: Check availability <https://pricing.snapeda.com/parts/LM2596DSADJG/ON%20Semiconductor/view-part?ref=eda>; AVAILABILITY: In Stock; CHECK_PRICES: https://www.snapeda.com/parts/LM2596DSADJG/Onsemi/view-part/?ref=eda; DESCRIPTION: LM2596DSADJG Switching Regulator 3A Adjustable, 1.23 to 37 V, 5-Pin D2PAK | ON Semiconductor LM2596DSADJG; MF: ON Semiconductor; MP: LM2596DSADJG; PACKAGE: D2PAK-5 ON Semiconductor; PRICE: None; SNAPEDA_LINK: https://www.snapeda.com/parts/LM2596DSADJG/Onsemi/view-part/?ref=snap
U3 = 3V3 regulator:LD39150DT33-R: Check availability <https://pricing.snapeda.com/parts/IPB60R165CP/Infineon/view-part?ref=eda>; AVAILABILITY: In Stock; CHECK_PRICES: https://www.snapeda.com/parts/IPB60R165CP/Infineon/view-part/?ref=eda; DESCRIPTION: N-Channel 600 V 21A (Tc) 192W (Tc) Surface Mount PG-TO263-3-2; MF: Infineon; MP: IPB60R165CP; PACKAGE: TO-263 Infineon; PRICE: None; SNAPEDA_LINK: https://www.snapeda.com/parts/IPB60R165CP/Infineon/view-part/?ref=snap
U4 = ULN2003:ULN2003LVDR: Check availability <https://pricing.snapeda.com/parts/ULN2003LVDR/Texas%20Instruments/view-part?ref=eda>; AVAILABILITY: In Stock; CHECK_PRICES: https://www.snapeda.com/parts/ULN2003LVDR/Texas+Instruments/view-part/?ref=eda; DESCRIPTION: 50-V, 7-ch NMOS array low-side driver; MF: Texas Instruments; MP: ULN2003LVDR; PACKAGE: SOIC-16 Texas Instruments; PRICE: None; SNAPEDA_LINK: https://www.snapeda.com/parts/ULN2003LVDR/Texas+Instruments/view-part/?ref=snap
U5 = MCP2562:MCP2562-E/SN: Check availability <https://pricing.snapeda.com/parts/MCP2562-E/SN/Microchip/view-part?ref=eda>; AVAILABILITY: In Stock; CHECK_PRICES: https://www.snapeda.com/parts/MCP2562-E/SN/Microchip/view-part/?ref=eda; DESCRIPTION: Microchip MCP2562-E/SN,CAN Transceiver 1MBps 1-channel IEC 61000-4-2,8-Pin SOIC | Microchip Technology Inc. MCP2562-E/SN; MF: Microchip; MP: MCP2562-E/SN; PACKAGE: SO-8 Microchip; PRICE: None; SNAPEDA_LINK: https://www.snapeda.com/parts/MCP2562-E/SN/Microchip/view-part/?ref=snap
VR2 = Trimmer 1k:3296W-1-502: Check availability <https://pricing.snapeda.com/parts/3296W-1-502/Bourns/view-part?ref=eda>; AVAILABILITY: In Stock; CHECK_PRICES: https://www.snapeda.com/parts/3296W-1-502/Bourns/view-part/?ref=eda; DESCRIPTION: NON-RoHS, 3/8 Sq, Thru-Hole, TRIMMER, 5 Kohms, Cermet, 25 Turns, Pwr-Rtg 0.5W | Bourns 3296W-1-502; MF: Bourns; MP: 3296W-1-502; PACKAGE: NON STANDARD-3 Bourns; PRICE: None; SNAPEDA_LINK: https://www.snapeda.com/parts/3296W-1-502/Bourns/view-part/?ref=snap
VR3 = Trimmer 10k:3299Y-1-104LF: Check availability <https://pricing.snapeda.com/parts/3299Y-1-104LF/Bourns/view-part?ref=eda>; AVAILABILITY: In Stock; CHECK_PRICES: https://www.snapeda.com/parts/3299Y-1-104LF/Bourns/view-part/?ref=eda; DESCRIPTION: Trimmer, Cermet, Rest 100 Kilohms, PCB, 25 Turns, Pwr-Rtg 0.5W | Bourns 3299Y-1-104LF; MF: Bourns; MP: 3299Y-1-104LF; PACKAGE: DIP-3 Bourns; PRICE: None; SNAPEDA_LINK: https://www.snapeda.com/parts/3299Y-1-104LF/Bourns/view-part/?ref=snap